# Altium project S7CAS-PLEIADES-CARTE-MERE_P20.PrjPcb (part 5 of 5)
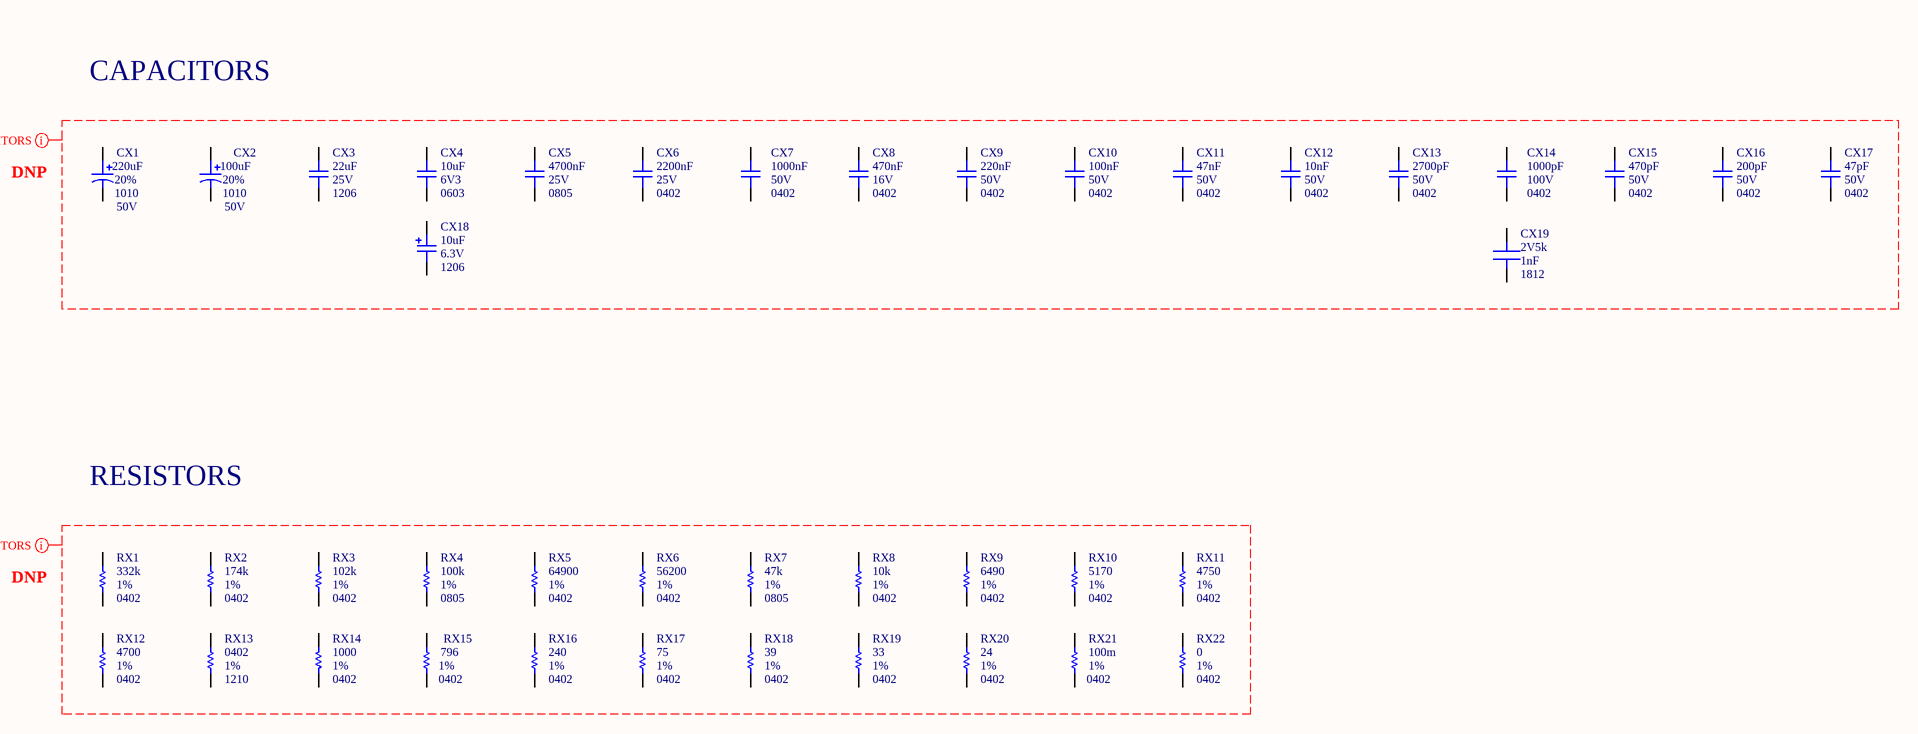
[diagram p20: S7CAS-PLEIADES-CARTE-MERE_P20_Passive-Components.SchDoc]

## Nets that join several sheets
0V75: S7CAS-PLEIADES-CARTE-MERE_P20_Power-Tree-3 (6 pins), S7CAS-PLEIADES-CARTE-MERE_P20_DDR3-FPGA-Bank-3 (18 pins), S7CAS-PLEIADES-CARTE-MERE_P20_DDR3-Decoupling (28 pins)
0V75_VTTREF: S7CAS-PLEIADES-CARTE-MERE_P20_Power-Tree-3 (U10.6), S7CAS-PLEIADES-CARTE-MERE_P20_DDR3-FPGA-Bank-3 (6 pins), S7CAS-PLEIADES-CARTE-MERE_P20_DDR3-Decoupling (C117.2 C118.2)
1V2: S7CAS-PLEIADES-CARTE-MERE_P20_Power-Tree-2 (9 pins), S7CAS-PLEIADES-CARTE-MERE_P20_FPGA-Decoupling (31 pins)
1V5: S7CAS-PLEIADES-CARTE-MERE_P20_Power-Tree-3 (10 pins), S7CAS-PLEIADES-CARTE-MERE_P20_DDR3-FPGA-Bank-3 (28 pins), S7CAS-PLEIADES-CARTE-MERE_P20_DDR3-Decoupling (12 pins), S7CAS-PLEIADES-CARTE-MERE_P20_FPGA-Decoupling (5 pins), S7CAS-PLEIADES-CARTE-MERE_P20_ADC (C254.1 U21.23)
1V8: S7CAS-PLEIADES-CARTE-MERE_P20_Power-Tree-3 (15 pins), S7CAS-PLEIADES-CARTE-MERE_P20_DAC-ADC-Decoupling (27 pins)
3V3_ANAL: S7CAS-PLEIADES-CARTE-MERE_P20_Power-Tree-3 (6 pins), S7CAS-PLEIADES-CARTE-MERE_P20_Ethernet (C194.2 L2.2), S7CAS-PLEIADES-CARTE-MERE_P20_USB (M1.2 M1.8 R98.2), S7CAS-PLEIADES-CARTE-MERE_P20_PLL (C179.1 L1.1), S7CAS-PLEIADES-CARTE-MERE_P20_DAC-ADC-Decoupling (C263.1 C272.1 L16.1 L17.1), S7CAS-PLEIADES-CARTE-MERE_P20_Motor (R154.2)
3V3_DIGI: S7CAS-PLEIADES-CARTE-MERE_P20_Power-Tree-1 (8 pins), S7CAS-PLEIADES-CARTE-MERE_P20_Power-Tree-2 (C27.1 C40.2 U6.2 U6.9), S7CAS-PLEIADES-CARTE-MERE_P20_Power-Tree-3 (7 pins), S7CAS-PLEIADES-CARTE-MERE_P20_Flash-Sensors-FPGA-bank-2 (25 pins), S7CAS-PLEIADES-CARTE-MERE_P20_Mechanical-FPGA-Bank-0 (12 pins), S7CAS-PLEIADES-CARTE-MERE_P20_FPGA-Unused-Banks (21 pins), S7CAS-PLEIADES-CARTE-MERE_P20_FPGA-Decoupling (53 pins), S7CAS-PLEIADES-CARTE-MERE_P20_Ethernet (C199.2 C200.2 U17.17 Y2.4), S7CAS-PLEIADES-CARTE-MERE_P20_USB (17 pins), S7CAS-PLEIADES-CARTE-MERE_P20_PLL (25 pins), S7CAS-PLEIADES-CARTE-MERE_P20_Motor (R157.2 U23.10)
5V_ANAL: S7CAS-PLEIADES-CARTE-MERE_P20_Power-Tree-1 (7 pins), S7CAS-PLEIADES-CARTE-MERE_P20_Power-Tree-3 (6 pins), S7CAS-PLEIADES-CARTE-MERE_P20_DAC (L8.1), S7CAS-PLEIADES-CARTE-MERE_P20_ADC (L10.1)
5V_N: S7CAS-PLEIADES-CARTE-MERE_P20_Power-Tree-2 (7 pins), S7CAS-PLEIADES-CARTE-MERE_P20_DAC (L9.1), S7CAS-PLEIADES-CARTE-MERE_P20_ADC (L13.1)
6V: S7CAS-PLEIADES-CARTE-MERE_P20_Power-Tree-1 (14 pins), S7CAS-PLEIADES-CARTE-MERE_P20_Power-Tree-2 (C24.2 C29.2 R6.2 U4.26)
24V: S7CAS-PLEIADES-CARTE-MERE_P20_Power-Tree-1 (5 pins), S7CAS-PLEIADES-CARTE-MERE_P20_Motor (6 pins)
GND: S7CAS-PLEIADES-CARTE-MERE_P20_Power-Tree-1 (42 pins), S7CAS-PLEIADES-CARTE-MERE_P20_Power-Tree-2 (47 pins), S7CAS-PLEIADES-CARTE-MERE_P20_Power-Tree-3 (45 pins), S7CAS-PLEIADES-CARTE-MERE_P20_DDR3-FPGA-Bank-3 (23 pins), S7CAS-PLEIADES-CARTE-MERE_P20_DDR3-Decoupling (42 pins), S7CAS-PLEIADES-CARTE-MERE_P20_Flash-Sensors-FPGA-bank-2 (12 pins), S7CAS-PLEIADES-CARTE-MERE_P20_Mechanical-FPGA-Bank-0 (7 pins), S7CAS-PLEIADES-CARTE-MERE_P20_FPGA-Decoupling (117 pins), S7CAS-PLEIADES-CARTE-MERE_P20_Ethernet (24 pins), S7CAS-PLEIADES-CARTE-MERE_P20_USB (20 pins), S7CAS-PLEIADES-CARTE-MERE_P20_PLL (33 pins), S7CAS-PLEIADES-CARTE-MERE_P20_DAC (35 pins), S7CAS-PLEIADES-CARTE-MERE_P20_ADC (20 pins), S7CAS-PLEIADES-CARTE-MERE_P20_DAC-ADC-Decoupling (52 pins), S7CAS-PLEIADES-CARTE-MERE_P20_Motor (16 pins)
ADC_CTRL1: S7CAS-PLEIADES-CARTE-MERE_P20_Mechanical-FPGA-Bank-0 (U11.A7), S7CAS-PLEIADES-CARTE-MERE_P20_ADC (U21.35)
ADC_CTRL2: S7CAS-PLEIADES-CARTE-MERE_P20_Mechanical-FPGA-Bank-0 (U11.D6), S7CAS-PLEIADES-CARTE-MERE_P20_ADC (U21.36)
ADC_CTRL3: S7CAS-PLEIADES-CARTE-MERE_P20_Mechanical-FPGA-Bank-0 (U11.C6), S7CAS-PLEIADES-CARTE-MERE_P20_ADC (U21.37)
ADC_DA0_N: S7CAS-PLEIADES-CARTE-MERE_P20_Mechanical-FPGA-Bank-0 (U11.H17), S7CAS-PLEIADES-CARTE-MERE_P20_ADC (U21.40)
ADC_DA0_P: S7CAS-PLEIADES-CARTE-MERE_P20_Mechanical-FPGA-Bank-0 (U11.J17), S7CAS-PLEIADES-CARTE-MERE_P20_ADC (U21.41)
ADC_DA1_N: S7CAS-PLEIADES-CARTE-MERE_P20_Mechanical-FPGA-Bank-0 (U11.A19), S7CAS-PLEIADES-CARTE-MERE_P20_ADC (U21.42)
ADC_DA1_P: S7CAS-PLEIADES-CARTE-MERE_P20_Mechanical-FPGA-Bank-0 (U11.C19), S7CAS-PLEIADES-CARTE-MERE_P20_ADC (U21.43)
ADC_DA2_N: S7CAS-PLEIADES-CARTE-MERE_P20_Mechanical-FPGA-Bank-0 (U11.A20), S7CAS-PLEIADES-CARTE-MERE_P20_ADC (U21.44)
ADC_DA2_P: S7CAS-PLEIADES-CARTE-MERE_P20_Mechanical-FPGA-Bank-0 (U11.B20), S7CAS-PLEIADES-CARTE-MERE_P20_ADC (U21.45)
ADC_DA3_N: S7CAS-PLEIADES-CARTE-MERE_P20_Mechanical-FPGA-Bank-0 (U11.A21), S7CAS-PLEIADES-CARTE-MERE_P20_ADC (U21.46)
ADC_DA3_P: S7CAS-PLEIADES-CARTE-MERE_P20_Mechanical-FPGA-Bank-0 (U11.C21), S7CAS-PLEIADES-CARTE-MERE_P20_ADC (U21.47)
ADC_DA4_N: S7CAS-PLEIADES-CARTE-MERE_P20_Mechanical-FPGA-Bank-0 (U11.A22), S7CAS-PLEIADES-CARTE-MERE_P20_ADC (U21.50)
ADC_DA4_P: S7CAS-PLEIADES-CARTE-MERE_P20_Mechanical-FPGA-Bank-0 (U11.B22), S7CAS-PLEIADES-CARTE-MERE_P20_ADC (U21.51)
ADC_DA5_N: S7CAS-PLEIADES-CARTE-MERE_P20_Mechanical-FPGA-Bank-0 (U11.E9), S7CAS-PLEIADES-CARTE-MERE_P20_ADC (U21.52)
ADC_DA5_P: S7CAS-PLEIADES-CARTE-MERE_P20_Mechanical-FPGA-Bank-0 (U11.F9), S7CAS-PLEIADES-CARTE-MERE_P20_ADC (U21.53)
ADC_DA6_N: S7CAS-PLEIADES-CARTE-MERE_P20_Mechanical-FPGA-Bank-0 (U11.A8), S7CAS-PLEIADES-CARTE-MERE_P20_ADC (U21.54)
ADC_DA6_P: S7CAS-PLEIADES-CARTE-MERE_P20_Mechanical-FPGA-Bank-0 (U11.B8), S7CAS-PLEIADES-CARTE-MERE_P20_ADC (U21.55)
ADC_DB0_N: S7CAS-PLEIADES-CARTE-MERE_P20_Mechanical-FPGA-Bank-0 (U11.A9), S7CAS-PLEIADES-CARTE-MERE_P20_ADC (U21.60)
ADC_DB0_P: S7CAS-PLEIADES-CARTE-MERE_P20_Mechanical-FPGA-Bank-0 (U11.C9), S7CAS-PLEIADES-CARTE-MERE_P20_ADC (U21.61)
ADC_DB1_N: S7CAS-PLEIADES-CARTE-MERE_P20_Mechanical-FPGA-Bank-0 (U11.F10), S7CAS-PLEIADES-CARTE-MERE_P20_ADC (U21.62)
ADC_DB1_P: S7CAS-PLEIADES-CARTE-MERE_P20_Mechanical-FPGA-Bank-0 (U11.E10), S7CAS-PLEIADES-CARTE-MERE_P20_ADC (U21.63)
ADC_DB2_N: S7CAS-PLEIADES-CARTE-MERE_P20_Mechanical-FPGA-Bank-0 (U11.C10), S7CAS-PLEIADES-CARTE-MERE_P20_ADC (U21.2)
ADC_DB2_P: S7CAS-PLEIADES-CARTE-MERE_P20_Mechanical-FPGA-Bank-0 (U11.D10), S7CAS-PLEIADES-CARTE-MERE_P20_ADC (U21.3)
ADC_DB3_N: S7CAS-PLEIADES-CARTE-MERE_P20_Mechanical-FPGA-Bank-0 (U11.A10), S7CAS-PLEIADES-CARTE-MERE_P20_ADC (U21.4)
ADC_DB3_P: S7CAS-PLEIADES-CARTE-MERE_P20_Mechanical-FPGA-Bank-0 (U11.B10), S7CAS-PLEIADES-CARTE-MERE_P20_ADC (U21.5)
ADC_DB4_N: S7CAS-PLEIADES-CARTE-MERE_P20_Mechanical-FPGA-Bank-0 (U11.F11), S7CAS-PLEIADES-CARTE-MERE_P20_ADC (U21.6)
ADC_DB4_P: S7CAS-PLEIADES-CARTE-MERE_P20_Mechanical-FPGA-Bank-0 (U11.D11), S7CAS-PLEIADES-CARTE-MERE_P20_ADC (U21.7)
ADC_DB5_N: S7CAS-PLEIADES-CARTE-MERE_P20_Mechanical-FPGA-Bank-0 (U11.A11), S7CAS-PLEIADES-CARTE-MERE_P20_ADC (U21.8)
ADC_DB5_P: S7CAS-PLEIADES-CARTE-MERE_P20_Mechanical-FPGA-Bank-0 (U11.C11), S7CAS-PLEIADES-CARTE-MERE_P20_ADC (U21.9)
ADC_DB6_N: S7CAS-PLEIADES-CARTE-MERE_P20_Mechanical-FPGA-Bank-0 (U11.A12), S7CAS-PLEIADES-CARTE-MERE_P20_ADC (U21.10)
ADC_DB6_P: S7CAS-PLEIADES-CARTE-MERE_P20_Mechanical-FPGA-Bank-0 (U11.B12), S7CAS-PLEIADES-CARTE-MERE_P20_ADC (U21.11)
ADC_RESET: S7CAS-PLEIADES-CARTE-MERE_P20_Mechanical-FPGA-Bank-0 (U11.F7), S7CAS-PLEIADES-CARTE-MERE_P20_ADC (U21.12)
ADC_SCLK: S7CAS-PLEIADES-CARTE-MERE_P20_Mechanical-FPGA-Bank-0 (U11.B6), S7CAS-PLEIADES-CARTE-MERE_P20_ADC (U21.13)
ADC_SDATA: S7CAS-PLEIADES-CARTE-MERE_P20_Mechanical-FPGA-Bank-0 (U11.C7), S7CAS-PLEIADES-CARTE-MERE_P20_ADC (U21.14)
ADC_SDOUT: S7CAS-PLEIADES-CARTE-MERE_P20_Mechanical-FPGA-Bank-0 (U11.D7), S7CAS-PLEIADES-CARTE-MERE_P20_ADC (R151.1)
ADC_SEN: S7CAS-PLEIADES-CARTE-MERE_P20_Mechanical-FPGA-Bank-0 (U11.A6), S7CAS-PLEIADES-CARTE-MERE_P20_ADC (U21.15)
DAC_CS_N: S7CAS-PLEIADES-CARTE-MERE_P20_Mechanical-FPGA-Bank-0 (U11.E14), S7CAS-PLEIADES-CARTE-MERE_P20_DAC (U19.33)
DAC_D0_N: S7CAS-PLEIADES-CARTE-MERE_P20_Mechanical-FPGA-Bank-0 (U11.F15), S7CAS-PLEIADES-CARTE-MERE_P20_DAC (R119.1 U19.28)
DAC_D0_P: S7CAS-PLEIADES-CARTE-MERE_P20_Mechanical-FPGA-Bank-0 (U11.G16), S7CAS-PLEIADES-CARTE-MERE_P20_DAC (R117.1 U19.27)
DAC_D1_N: S7CAS-PLEIADES-CARTE-MERE_P20_Mechanical-FPGA-Bank-0 (U11.E17), S7CAS-PLEIADES-CARTE-MERE_P20_DAC (R123.1 U19.26)
DAC_D1_P: S7CAS-PLEIADES-CARTE-MERE_P20_Mechanical-FPGA-Bank-0 (U11.F17), S7CAS-PLEIADES-CARTE-MERE_P20_DAC (R121.1 U19.25)
DAC_D2_N: S7CAS-PLEIADES-CARTE-MERE_P20_Mechanical-FPGA-Bank-0 (U11.E16), S7CAS-PLEIADES-CARTE-MERE_P20_DAC (R127.1 U19.24)
DAC_D2_P: S7CAS-PLEIADES-CARTE-MERE_P20_Mechanical-FPGA-Bank-0 (U11.F16), S7CAS-PLEIADES-CARTE-MERE_P20_DAC (R125.1 U19.23)
DAC_D3_N: S7CAS-PLEIADES-CARTE-MERE_P20_Mechanical-FPGA-Bank-0 (U11.A17), S7CAS-PLEIADES-CARTE-MERE_P20_DAC (R131.1 U19.22)
DAC_D3_P: S7CAS-PLEIADES-CARTE-MERE_P20_Mechanical-FPGA-Bank-0 (U11.C17), S7CAS-PLEIADES-CARTE-MERE_P20_DAC (R129.1 U19.21)
DAC_D4_N: S7CAS-PLEIADES-CARTE-MERE_P20_Mechanical-FPGA-Bank-0 (U11.H15), S7CAS-PLEIADES-CARTE-MERE_P20_DAC (R135.1 U19.16)
DAC_D4_P: S7CAS-PLEIADES-CARTE-MERE_P20_Mechanical-FPGA-Bank-0 (U11.J15), S7CAS-PLEIADES-CARTE-MERE_P20_DAC (R133.1 U19.15)
DAC_D5_N: S7CAS-PLEIADES-CARTE-MERE_P20_Mechanical-FPGA-Bank-0 (U11.C18), S7CAS-PLEIADES-CARTE-MERE_P20_DAC (R120.1 U19.14)
DAC_D5_P: S7CAS-PLEIADES-CARTE-MERE_P20_Mechanical-FPGA-Bank-0 (U11.D18), S7CAS-PLEIADES-CARTE-MERE_P20_DAC (R118.1 U19.13)
DAC_D6_N: S7CAS-PLEIADES-CARTE-MERE_P20_Mechanical-FPGA-Bank-0 (U11.D19), S7CAS-PLEIADES-CARTE-MERE_P20_DAC (R124.1 U19.12)
DAC_D6_P: S7CAS-PLEIADES-CARTE-MERE_P20_Mechanical-FPGA-Bank-0 (U11.E19), S7CAS-PLEIADES-CARTE-MERE_P20_DAC (R122.1 U19.11)
DAC_D7_N: S7CAS-PLEIADES-CARTE-MERE_P20_Mechanical-FPGA-Bank-0 (U11.G17), S7CAS-PLEIADES-CARTE-MERE_P20_DAC (R128.1 U19.10)
DAC_D7_P: S7CAS-PLEIADES-CARTE-MERE_P20_Mechanical-FPGA-Bank-0 (U11.H16), S7CAS-PLEIADES-CARTE-MERE_P20_DAC (R126.1 U19.9)
DAC_DCI_N: S7CAS-PLEIADES-CARTE-MERE_P20_Mechanical-FPGA-Bank-0 (U11.C20), S7CAS-PLEIADES-CARTE-MERE_P20_DAC (R132.1 U19.18)
DAC_DCI_P: S7CAS-PLEIADES-CARTE-MERE_P20_Mechanical-FPGA-Bank-0 (U11.D21), S7CAS-PLEIADES-CARTE-MERE_P20_DAC (R130.1 U19.17)
DAC_FRAME_N: S7CAS-PLEIADES-CARTE-MERE_P20_Mechanical-FPGA-Bank-0 (U11.E18), S7CAS-PLEIADES-CARTE-MERE_P20_DAC (R136.1 U19.20)
DAC_FRAME_P: S7CAS-PLEIADES-CARTE-MERE_P20_Mechanical-FPGA-Bank-0 (U11.F18), S7CAS-PLEIADES-CARTE-MERE_P20_DAC (R134.1 U19.19)
DAC_IRQ_N: S7CAS-PLEIADES-CARTE-MERE_P20_Mechanical-FPGA-Bank-0 (U11.D15), S7CAS-PLEIADES-CARTE-MERE_P20_DAC (U19.34)
DAC_RESET_N: S7CAS-PLEIADES-CARTE-MERE_P20_Mechanical-FPGA-Bank-0 (U11.J14), S7CAS-PLEIADES-CARTE-MERE_P20_DAC (U19.36)
DAC_SCLK: S7CAS-PLEIADES-CARTE-MERE_P20_Mechanical-FPGA-Bank-0 (U11.G14), S7CAS-PLEIADES-CARTE-MERE_P20_DAC (U19.32)
DAC_SDIO: S7CAS-PLEIADES-CARTE-MERE_P20_Mechanical-FPGA-Bank-0 (U11.B16), S7CAS-PLEIADES-CARTE-MERE_P20_DAC (R102.2)
DAC_TXEN: S7CAS-PLEIADES-CARTE-MERE_P20_Mechanical-FPGA-Bank-0 (U11.D16), S7CAS-PLEIADES-CARTE-MERE_P20_DAC (U19.30)
DRV_DIR: S7CAS-PLEIADES-CARTE-MERE_P20_Flash-Sensors-FPGA-bank-2 (U11.Y10), S7CAS-PLEIADES-CARTE-MERE_P20_Motor (U23.3)
DRV_EN_N: S7CAS-PLEIADES-CARTE-MERE_P20_Flash-Sensors-FPGA-bank-2 (U11.AF10), S7CAS-PLEIADES-CARTE-MERE_P20_Motor (U23.26)
DRV_HOME_N: S7CAS-PLEIADES-CARTE-MERE_P20_Flash-Sensors-FPGA-bank-2 (U11.AC20), S7CAS-PLEIADES-CARTE-MERE_P20_Motor (U23.2)
DRV_RESET_N: S7CAS-PLEIADES-CARTE-MERE_P20_Flash-Sensors-FPGA-bank-2 (U11.AD10), S7CAS-PLEIADES-CARTE-MERE_P20_Motor (U23.17)
DRV_SLEEP_N: S7CAS-PLEIADES-CARTE-MERE_P20_Flash-Sensors-FPGA-bank-2 (U11.U13), S7CAS-PLEIADES-CARTE-MERE_P20_Motor (U23.27)
DRV_SR_N: S7CAS-PLEIADES-CARTE-MERE_P20_Flash-Sensors-FPGA-bank-2 (U11.W11), S7CAS-PLEIADES-CARTE-MERE_P20_Motor (U23.16)
DRV_STEP: S7CAS-PLEIADES-CARTE-MERE_P20_Flash-Sensors-FPGA-bank-2 (U11.U12), S7CAS-PLEIADES-CARTE-MERE_P20_Motor (U23.19)
DRV_USM0: S7CAS-PLEIADES-CARTE-MERE_P20_Flash-Sensors-FPGA-bank-2 (U11.AB10), S7CAS-PLEIADES-CARTE-MERE_P20_Motor (U23.13)
DRV_USM1: S7CAS-PLEIADES-CARTE-MERE_P20_Flash-Sensors-FPGA-bank-2 (U11.V11), S7CAS-PLEIADES-CARTE-MERE_P20_Motor (U23.12)
LED_DEBUG1: S7CAS-PLEIADES-CARTE-MERE_P20_Flash-Sensors-FPGA-bank-2 (R51.2), S7CAS-PLEIADES-CARTE-MERE_P20_Mechanical-FPGA-Bank-0 (U11.C12)
LED_DEBUG3: S7CAS-PLEIADES-CARTE-MERE_P20_Flash-Sensors-FPGA-bank-2 (R56.2), S7CAS-PLEIADES-CARTE-MERE_P20_Mechanical-FPGA-Bank-0 (U11.F13)
PHY_COL: S7CAS-PLEIADES-CARTE-MERE_P20_Flash-Sensors-FPGA-bank-2 (U11.AA12), S7CAS-PLEIADES-CARTE-MERE_P20_Ethernet (R66.2)
PHY_CRS: S7CAS-PLEIADES-CARTE-MERE_P20_Flash-Sensors-FPGA-bank-2 (U11.W13), S7CAS-PLEIADES-CARTE-MERE_P20_Ethernet (R67.2)
PHY_INTRP: S7CAS-PLEIADES-CARTE-MERE_P20_Flash-Sensors-FPGA-bank-2 (U11.Y13), S7CAS-PLEIADES-CARTE-MERE_P20_Ethernet (U17.21)
PHY_MDC: S7CAS-PLEIADES-CARTE-MERE_P20_Flash-Sensors-FPGA-bank-2 (U11.AC19), S7CAS-PLEIADES-CARTE-MERE_P20_Ethernet (U17.12)
PHY_MDIO: S7CAS-PLEIADES-CARTE-MERE_P20_Flash-Sensors-FPGA-bank-2 (U11.AA19), S7CAS-PLEIADES-CARTE-MERE_P20_Ethernet (R62.1 U17.11)
PHY_RST_N: S7CAS-PLEIADES-CARTE-MERE_P20_Flash-Sensors-FPGA-bank-2 (U11.W17), S7CAS-PLEIADES-CARTE-MERE_P20_Ethernet (U17.32)
PHY_RXD0: S7CAS-PLEIADES-CARTE-MERE_P20_Flash-Sensors-FPGA-bank-2 (U11.Y18), S7CAS-PLEIADES-CARTE-MERE_P20_Ethernet (R71.2)
PHY_RXD1: S7CAS-PLEIADES-CARTE-MERE_P20_Flash-Sensors-FPGA-bank-2 (U11.AD18), S7CAS-PLEIADES-CARTE-MERE_P20_Ethernet (R72.2)
PHY_RXD2: S7CAS-PLEIADES-CARTE-MERE_P20_Flash-Sensors-FPGA-bank-2 (U11.AF18), S7CAS-PLEIADES-CARTE-MERE_P20_Ethernet (R73.2)
PHY_RXD3: S7CAS-PLEIADES-CARTE-MERE_P20_Flash-Sensors-FPGA-bank-2 (U11.AD19), S7CAS-PLEIADES-CARTE-MERE_P20_Ethernet (R74.2)
PHY_RXDC: S7CAS-PLEIADES-CARTE-MERE_P20_Flash-Sensors-FPGA-bank-2 (U11.Y16), S7CAS-PLEIADES-CARTE-MERE_P20_Ethernet (R75.2)
PHY_RXDV: S7CAS-PLEIADES-CARTE-MERE_P20_Flash-Sensors-FPGA-bank-2 (U11.AA17), S7CAS-PLEIADES-CARTE-MERE_P20_Ethernet (R69.2)
PHY_RXER: S7CAS-PLEIADES-CARTE-MERE_P20_Flash-Sensors-FPGA-bank-2 (U11.V14), S7CAS-PLEIADES-CARTE-MERE_P20_Ethernet (R70.2)
PHY_STANDBY: S7CAS-PLEIADES-CARTE-MERE_P20_Flash-Sensors-FPGA-bank-2 (U11.W14), S7CAS-PLEIADES-CARTE-MERE_P20_Ethernet (Y2.1)
PHY_TXC: S7CAS-PLEIADES-CARTE-MERE_P20_Flash-Sensors-FPGA-bank-2 (U11.V16), S7CAS-PLEIADES-CARTE-MERE_P20_Ethernet (R78.2)
PHY_TXD0: S7CAS-PLEIADES-CARTE-MERE_P20_Flash-Sensors-FPGA-bank-2 (U11.AA13), S7CAS-PLEIADES-CARTE-MERE_P20_Ethernet (U17.24)
PHY_TXD1: S7CAS-PLEIADES-CARTE-MERE_P20_Flash-Sensors-FPGA-bank-2 (U11.AB11), S7CAS-PLEIADES-CARTE-MERE_P20_Ethernet (U17.25)
PHY_TXD2: S7CAS-PLEIADES-CARTE-MERE_P20_Flash-Sensors-FPGA-bank-2 (U11.AA11), S7CAS-PLEIADES-CARTE-MERE_P20_Ethernet (U17.26)
PHY_TXD3: S7CAS-PLEIADES-CARTE-MERE_P20_Flash-Sensors-FPGA-bank-2 (U11.V13), S7CAS-PLEIADES-CARTE-MERE_P20_Ethernet (U17.27)
PHY_TXEN: S7CAS-PLEIADES-CARTE-MERE_P20_Flash-Sensors-FPGA-bank-2 (U11.AB13), S7CAS-PLEIADES-CARTE-MERE_P20_Ethernet (U17.23)
PHY_TXER: S7CAS-PLEIADES-CARTE-MERE_P20_Flash-Sensors-FPGA-bank-2 (U11.U15), S7CAS-PLEIADES-CARTE-MERE_P20_Ethernet (U17.31)
PLL_100MHz_N: S7CAS-PLEIADES-CARTE-MERE_P20_Mechanical-FPGA-Bank-0 (U11.C14), S7CAS-PLEIADES-CARTE-MERE_P20_PLL (U16.28)
PLL_100MHz_P: S7CAS-PLEIADES-CARTE-MERE_P20_Mechanical-FPGA-Bank-0 (U11.D14), S7CAS-PLEIADES-CARTE-MERE_P20_PLL (U16.27)
PLL_200MHz_N: S7CAS-PLEIADES-CARTE-MERE_P20_PLL (U16.20), S7CAS-PLEIADES-CARTE-MERE_P20_ADC (C252.2 R152.2)
PLL_200MHz_P: S7CAS-PLEIADES-CARTE-MERE_P20_PLL (U16.19), S7CAS-PLEIADES-CARTE-MERE_P20_ADC (C251.2 R153.2)
PLL_400MHz_N: S7CAS-PLEIADES-CARTE-MERE_P20_PLL (U16.17), S7CAS-PLEIADES-CARTE-MERE_P20_DAC (R111.2 U19.4)
PLL_400MHz_P: S7CAS-PLEIADES-CARTE-MERE_P20_PLL (U16.16), S7CAS-PLEIADES-CARTE-MERE_P20_DAC (R110.2 U19.3)
PLL_SPI_CLK: S7CAS-PLEIADES-CARTE-MERE_P20_Mechanical-FPGA-Bank-0 (U11.A4), S7CAS-PLEIADES-CARTE-MERE_P20_PLL (U16.24)
PLL_SPI_LE: S7CAS-PLEIADES-CARTE-MERE_P20_Mechanical-FPGA-Bank-0 (U11.B4), S7CAS-PLEIADES-CARTE-MERE_P20_PLL (U16.25)
PLL_SPI_MISO: S7CAS-PLEIADES-CARTE-MERE_P20_Mechanical-FPGA-Bank-0 (U11.E6), S7CAS-PLEIADES-CARTE-MERE_P20_PLL (U16.23)
PLL_SPI_MOSI: S7CAS-PLEIADES-CARTE-MERE_P20_Mechanical-FPGA-Bank-0 (U11.D5), S7CAS-PLEIADES-CARTE-MERE_P20_PLL (U16.22)
PLL_SPI_REF_SEL: S7CAS-PLEIADES-CARTE-MERE_P20_Mechanical-FPGA-Bank-0 (U11.C5), S7CAS-PLEIADES-CARTE-MERE_P20_PLL (U16.31)
PLL_SPI_SYNC_N: S7CAS-PLEIADES-CARTE-MERE_P20_Mechanical-FPGA-Bank-0 (U11.A5), S7CAS-PLEIADES-CARTE-MERE_P20_PLL (U16.14)
PROGRAM_B: S7CAS-PLEIADES-CARTE-MERE_P20_Flash-Sensors-FPGA-bank-2 (R49.1 U11.AF3), S7CAS-PLEIADES-CARTE-MERE_P20_USB (R92.2)
TPS_EN: S7CAS-PLEIADES-CARTE-MERE_P20_Power-Tree-3 (U10.7), S7CAS-PLEIADES-CARTE-MERE_P20_DDR3-FPGA-Bank-3 (U11.L4)
TPS_PGOOD: S7CAS-PLEIADES-CARTE-MERE_P20_Power-Tree-3 (R15.1 U10.9), S7CAS-PLEIADES-CARTE-MERE_P20_DDR3-FPGA-Bank-3 (U11.L3)
UART_CTS: S7CAS-PLEIADES-CARTE-MERE_P20_Flash-Sensors-FPGA-bank-2 (U11.AF11), S7CAS-PLEIADES-CARTE-MERE_P20_USB (M1.3)
UART_RTS: S7CAS-PLEIADES-CARTE-MERE_P20_Flash-Sensors-FPGA-bank-2 (U11.AE11), S7CAS-PLEIADES-CARTE-MERE_P20_USB (R88.2)
UART_RXD: S7CAS-PLEIADES-CARTE-MERE_P20_Flash-Sensors-FPGA-bank-2 (U11.W12), S7CAS-PLEIADES-CARTE-MERE_P20_USB (M1.5)
UART_TXD: S7CAS-PLEIADES-CARTE-MERE_P20_Flash-Sensors-FPGA-bank-2 (U11.V12), S7CAS-PLEIADES-CARTE-MERE_P20_USB (R85.2)